# EAGLE design i2c_7SEG (EAGLE 5.10)
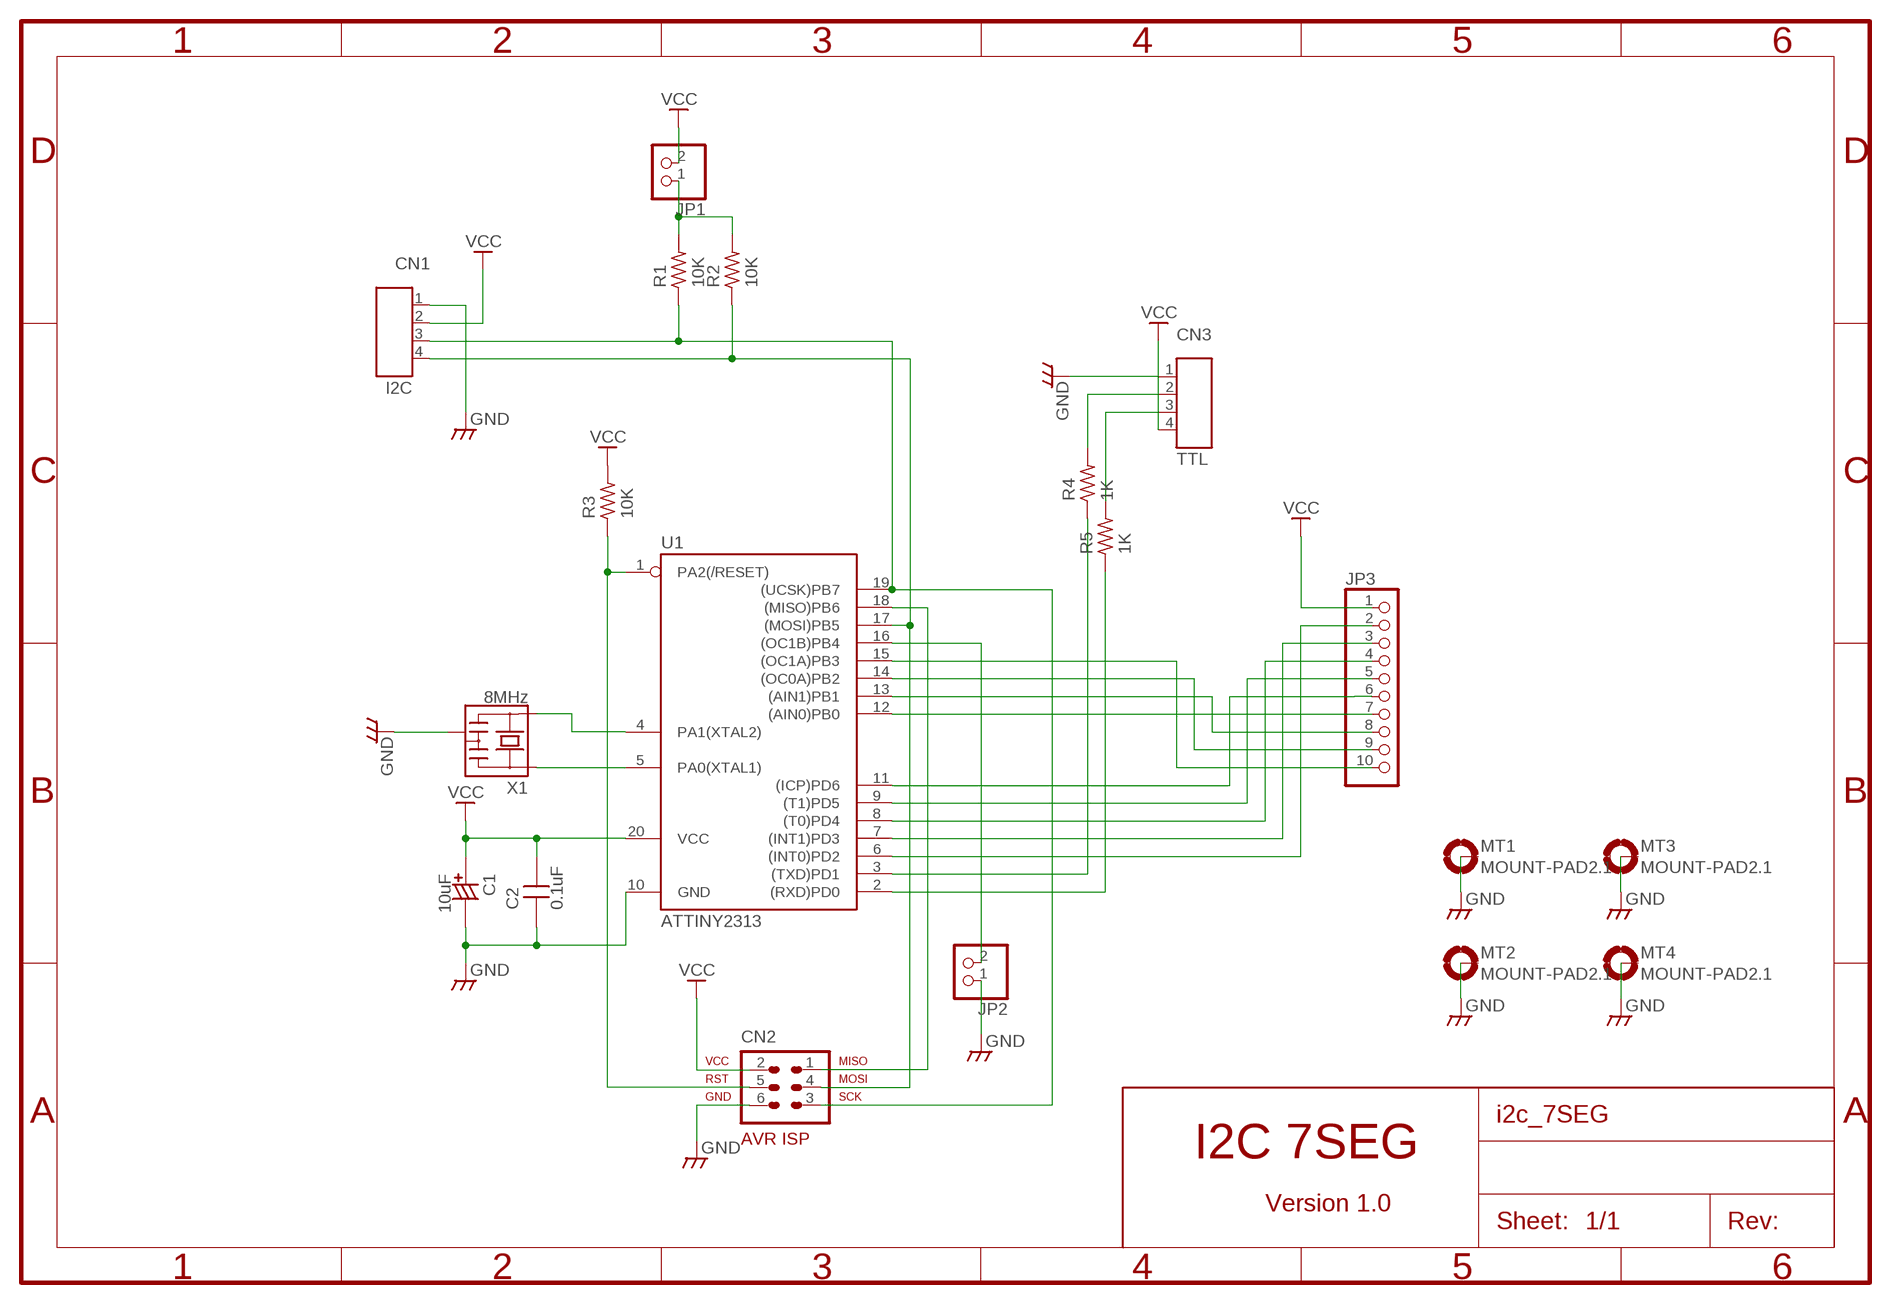
[diagram p0: schematic, sheet 1]

## Parts
C1  10uF  CCAP6.5  [CCAP_6.5]
C2  0.1uF  CAPDIP_2  [CAP_DIP_2]
CN1  I2C  CON_4P  [CON_HRS_DIP_4]
CN2  AVR-ISP-6NS  [2X3-NS]
CN3  TTL  CON_4P  [CON_HRS_DIP_4]
JP1  PINHD-1X02_2.54-90°  [1X02/90]
JP2  PINHD-1X02_2.54-90°  [1X02/90]
JP3  PINHD-1X10_2.54  [1X10]
MT1  MOUNT-PAD2.1  [PAD-2.1]
MT2  MOUNT-PAD2.1  [PAD-2.1]
MT3  MOUNT-PAD2.1  [PAD-2.1]
MT4  MOUNT-PAD2.1  [PAD-2.1]
R1  10K  R0.125W_3P  [R_0.125W_3]
R2  10K  R0.125W_3P  [R_0.125W_3]
R3  10K  R0.125W_3P  [R_0.125W_3]
R4  1K  R0.125W_3P  [R_0.125W_3]
R5  1K  R0.125W_3P  [R_0.125W_3]
U1  ATTINY2313  TINY2313-*P*  [DIL20]
X1  8MHz  CERALOCK  [CSTLS]

## Nets
GND: C1.- C2.1 CN1.1 CN2.6 CN3.1 JP2.1 MT1.B2,1(MOUNT) MT2.B2,1(MOUNT) MT3.B2,1(MOUNT) MT4.B2,1(MOUNT) U1.10(GND) X1.2
N$1: CN3.2 R4.2
N$2: CN3.3 R5.2
N$3: JP3.2 U1.6((INT0)PD2)
N$4: JP3.3 U1.7((INT1)PD3)
N$5: JP3.4 U1.8((T0)PD4)
N$6: JP3.5 U1.9((T1)PD5)
N$7: JP3.6 U1.11((ICP)PD6)
N$8: CN2.5 R3.1 U1.1(PA2(/RESET))
N$9: CN1.3 CN2.3 R1.1 U1.19((UCSK)PB7)
N$10: CN1.4 CN2.4 R2.1 U1.17((MOSI)PB5)
N$11: JP1.1 R1.2 R2.2
N$12: JP3.7 U1.12((AIN0)PB0)
N$13: R4.1 U1.3((TXD)PD1)
N$14: R5.1 U1.2((RXD)PD0)
N$15: CN2.1 U1.18((MISO)PB6)
N$16: JP2.2 U1.16((OC1B)PB4)
N$17: U1.4(PA1(XTAL2)) X1.3
N$18: U1.5(PA0(XTAL1)) X1.1
N$19: JP3.8 U1.13((AIN1)PB1)
N$20: JP3.9 U1.14((OC0A)PB2)
N$21: JP3.10 U1.15((OC1A)PB3)
VCC: C1.+ C2.2 CN1.2 CN2.2 CN3.4 JP1.2 JP3.1 R3.2 U1.20(VCC)

## Notes on the sheet
- I2C 7SEG
- Version 1.0

## Library data of the parts
C1 = MyLib:CCAP: Polar capacitor
C2 = MyLib:CAP: Non polar capacitor
CN1 CN3 = MyLib:CON_4P: 4P Molex Connector
CN2 = atmel:AVR-ISP-6: AVR ISP-6 Serial Programming Header
JP1 JP2 = pinheader:PINHD-1X02: PIN HEADER
JP3 = pinheader:PINHD-1X10: PIN HEADER
MT1-MT4 = MyLib:MOUNT-PAD: 2.1mm Mount Pad (Connectable to GND)
R1-R5 = MyLib:R: General Resiter 1/8W 1/4W 1/2W V/H
U1 = atmel:TINY2313*: Atmel Tiny2313 2K Flash, 128 bytes EEPROM, 128 bytes RAM
X1 = MyLib:CERALOCK: Ceralock Oscillator

## Board
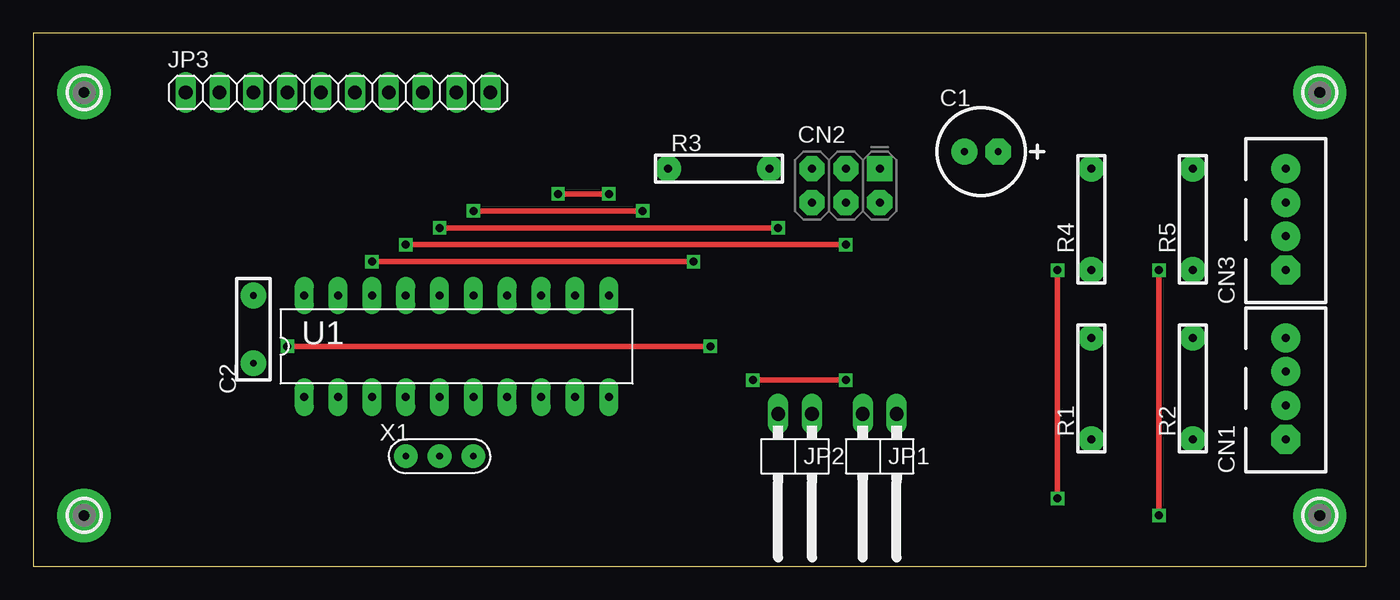
[diagram p1: board, top side]
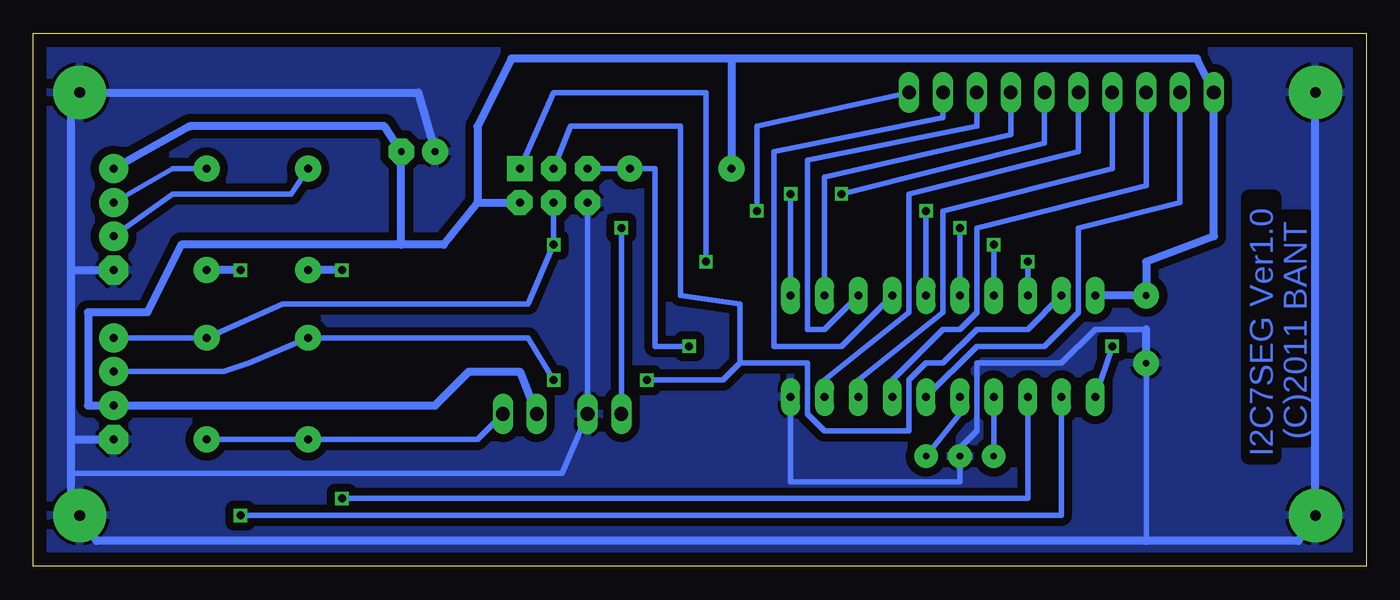
[diagram p2: board, bottom side, seen from below]

Size 100 x 40 mm. Coordinates in mm from the lower left corner, seen from the top.
Outline: 0,0 100,0 100,40 0,40 0,0
Copper layers (1*16): Top 0.035mm / dielectric 1.5mm / Bottom 0.035mm
Design rules "default": minimum track width 10mil, minimum drill 24mil, track to track 8mil, track to pad 8mil, pad to pad 8mil, via to via 8mil, smd to smd 8mil, copper to edge 40mil, drill to drill 8mil, minimum pad ring 10mil, minimum via ring 8mil, stop-mask expansion 4mil, vias tented up to drill 0mil, thermal gap 10mil

### Footprints (pad centres in the part's own frame; a part is rotated, then mirrored left to right if it is on the bottom)
CCAP_6.5 = drill 0.5 pad 1.93 octagon: + -1.27,0 | drill 0.5 pad 1.93 round: - 1.27,0
CAP_DIP_2 = drill 0.5 pad 1.93 round: 1 -2.54,0; 2 2.54,0
CON_HRS_DIP_4 = drill 0.6 pad 2.184 octagon: 1 -3.81,0 | drill 0.6 pad 2.184 round: 2 -1.27,0; 3 1.27,0; 4 3.81,0
2X3-NS = drill 0.6 pad 1.88 square: 1 -2.54,-1.27 | drill 0.6 pad 1.88 octagon: 2 -2.54,1.27; 3 0,-1.27; 4 0,1.27; 5 2.54,-1.27; 6 2.54,1.27
1X02/90 = drill 1.016 long: 1 -2.54,-3.81; 2 0,-3.81
1X10 = drill 1.016 long: 1 -11.43,0; 2 -8.89,0; 3 -6.35,0; 4 -3.81,0; 5 -1.27,0; 6 1.27,0; 7 3.81,0; 8 6.35,0; 9 8.89,0; 10 11.43,0
PAD-2.1 = drill 0.8 pad 4 round: B2,1 0,0
R_0.125W_3 = drill 0.6 pad 1.93 round: 1 -3.81,0; 2 3.81,0
DIL20 = drill 0.6 pad 1.422 long: 1 -11.43,-3.81; 2 -8.89,-3.81; 3 -6.35,-3.81; 4 -3.81,-3.81; 5 -1.27,-3.81; 6 1.27,-3.81; 7 3.81,-3.81; 8 6.35,-3.81; 9 8.89,-3.81; 10 11.43,-3.81; 11 11.43,3.81; 12 8.89,3.81; 13 6.35,3.81; 14 3.81,3.81; 15 1.27,3.81; 16 -1.27,3.81; 17 -3.81,3.81; 18 -6.35,3.81; 19 -8.89,3.81; 20 -11.43,3.81
CSTLS = drill 0.5 pad 1.778 round: 1 -2.54,0; 2 0,0; 3 2.54,0

### Placement (x,y rotation side)
C1  71.12,31.11 180 top
C2  16.51,17.78 90 top
CN1  93.98,13.34 90 top
CN2  60.96,28.57 180 top
CN3  93.98,26.04 90 top
JP1  62.23,7.62 180 top
JP2  55.88,7.62 180 top
JP3  22.86,35.56 0 top
MT1  96.52,35.56 0 top
MT2  96.52,3.81 0 top
MT3  3.81,3.81 90 top
MT4  3.81,35.56 0 top
R1  79.38,13.34 270 top
R2  87,13.34 270 top
R3  51.44,29.84 180 top
R4  79.38,26.04 90 top
R5  87,26.04 90 top
U1  31.75,16.51 0 top
X1  30.48,8.26 180 top

### Tracks (layer width: path | path; a pad name or v marks a point on that pad's centre or on a via)
GND
  Bottom 0.406: CN2.6 JP2.1 60.33,6.99 97.16,6.99 | U1.10 43.18,6.35 30.48,6.35 X1.2 30.48,8.89 29.21,10.16 29.21,15.24 22.86,15.24 20.32,17.78 16.51,17.78 | 97.16,4.45 96.52,4.45 MT2.B2,1 | 16.51,1.91 C2.1
  Bottom 0.61: C2.1 16.51,17.78 | MT2.B2,1 95.25,1.91 16.51,1.91 5.08,1.91 MT3.B2,1 MT4.B2,1 | 97.16,4.45 97.16,6.99 97.16,9.53 | 97.16,9.53 97.16,22.23 | 97.16,22.23 97.16,35.56 MT1.B2,1 71.12,35.56 C1.- | 97.16,9.53 CN1.1 | 97.16,22.23 CN3.1
  pour Bottom (isolate 0.61): 0,39.37 0,0 100.33,0 100.33,40.64 0,40.64
N$1
  Bottom 0.406: R4.2 80.64,27.94 89.53,27.94 CN3.2
N$2
  Bottom 0.406: R5.2 89.53,29.84 CN3.3
N$3
  Bottom 0.406: U1.6 29.21,16.51 24.13,16.51 21.59,19.05 21.59,25.4 13.97,27.3 JP3.2
N$4
  Bottom 0.406: U1.7 35.56,13.97 31.75,17.78 30.48,17.78 29.21,19.05 29.21,25.4 16.51,28.57 JP3.3
N$5
  Bottom 0.406: U1.8 38.1,13.97 31.75,19.05 31.75,26.67 19.05,29.84 JP3.4
N$6
  Bottom 0.406: U1.9 40.64,13.97 34.29,19.05 34.29,27.94 21.59,31.11 JP3.5
N$7  (via drill 0.6)
  Top 0.406: v39.37,27.94 v43.18,27.94
  Bottom 0.406: JP3.6 24.13,31.75 v39.37,27.94 | v43.18,27.94 U1.11
N$8  (via drill 0.6)
  Top 0.406: v19.05,16.51 v50.8,16.51
  Bottom 0.406: CN2.5 R3.1 53.34,29.84 53.34,16.51 v50.8,16.51 | U1.1 v19.05,16.51
N$9  (via drill 0.6)
  Top 0.406: v53.98,13.97 v60.96,13.97
  Bottom 0.254: CN2.3 60.96,29.21
  Bottom 0.406: CN1.3 85.72,14.61 83.82,15.24 R1.1 62.87,17.14 v60.96,13.97 | U1.19 25.4,17.78 29.21,17.78 31.75,15.24 33.02,15.24 34.29,13.97 34.29,10.16 40.64,10.16 41.91,11.43 41.91,15.24 46.99,15.24 | 46.99,15.24 48.26,13.97 v53.98,13.97 | CN2.3 59.69,33.02 51.44,33.02 51.44,20.32 46.99,19.68 46.99,15.24
N$10  (via drill 0.6)
  Top 0.406: v27.94,24.13 v60.96,24.13
  Bottom 0.406: CN2.4 v60.96,24.13 62.87,19.68 81.28,19.68 R2.1 | R2.1 86.36,17.14 | R2.1 CN1.4 | U1.17 v27.94,24.13
N$11
  Bottom 0.406: JP1.1 66.67,9.53 R1.2 R2.2
N$12
  Bottom 0.406: U1.12 40.64,29.21 26.67,32.38 JP3.7
N$13  (via drill 0.6)
  Top 0.406: v76.83,5.08 v76.83,22.23
  Bottom 0.406: U1.3 25.4,5.08 v76.83,5.08
  Bottom 0.61: v76.83,22.23 R4.1
N$14  (via drill 0.6)
  Top 0.406: v84.45,3.81 v84.45,22.23
  Bottom 0.406: U1.2 22.86,3.81 v84.45,3.81
  Bottom 0.61: v84.45,22.23 R5.1
N$15  (via drill 0.6)
  Top 0.406: v25.4,22.86 v49.53,22.86
  Bottom 0.406: CN2.1 60.96,35.56 49.53,35.56 v49.53,22.86 | U1.18 v25.4,22.86
N$16  (via drill 0.6)
  Top 0.406: v30.48,25.4 v55.88,25.4
  Bottom 0.406: U1.16 v30.48,25.4 | v55.88,25.4 JP2.2
N$17
  Bottom 0.406: X1.3 U1.4
N$18
  Bottom 0.406: X1.1 30.48,11.43 U1.5
N$19
  Bottom 0.406: U1.13 40.64,17.78 41.91,17.78 41.91,30.48 29.21,33.02 JP3.8
N$20
  Bottom 0.406: U1.14 39.37,16.51 44.45,16.51 44.45,31.11 31.75,33.66 JP3.9
N$21  (via drill 0.6)
  Top 0.406: v33.02,26.67 v45.72,26.67
  Bottom 0.406: JP3.10 45.72,33.02 v45.72,26.67 | U1.15 v33.02,26.67
VCC
  Bottom 0.406: CN1.2 94.61,12.06
  Bottom 0.61: JP1.2 63.5,14.61 67.31,14.61 69.85,12.06 CN1.2 95.89,12.06 95.89,19.05 91.44,19.05 88.9,24.13 72.39,24.13 | 66.67,27.3 CN2.2 | 47.62,38.1 12.7,38.1 JP3.1 11.43,24.77 16.51,22.86 C2.2 U1.20 | 47.62,38.1 R3.2 | 66.67,27.3 69.22,24.13 72.39,24.13 | CN3.4 88.27,33.02 73.66,33.02 C1.+ 72.39,24.13 | 47.62,38.1 64.14,38.1 66.67,33.02 66.67,27.3

### Text on the board
Bottom: (C)2011 BANT | I2C7SEG Ver1.0